# Altium project Center Console.PrjPcb (part 1 of 2)
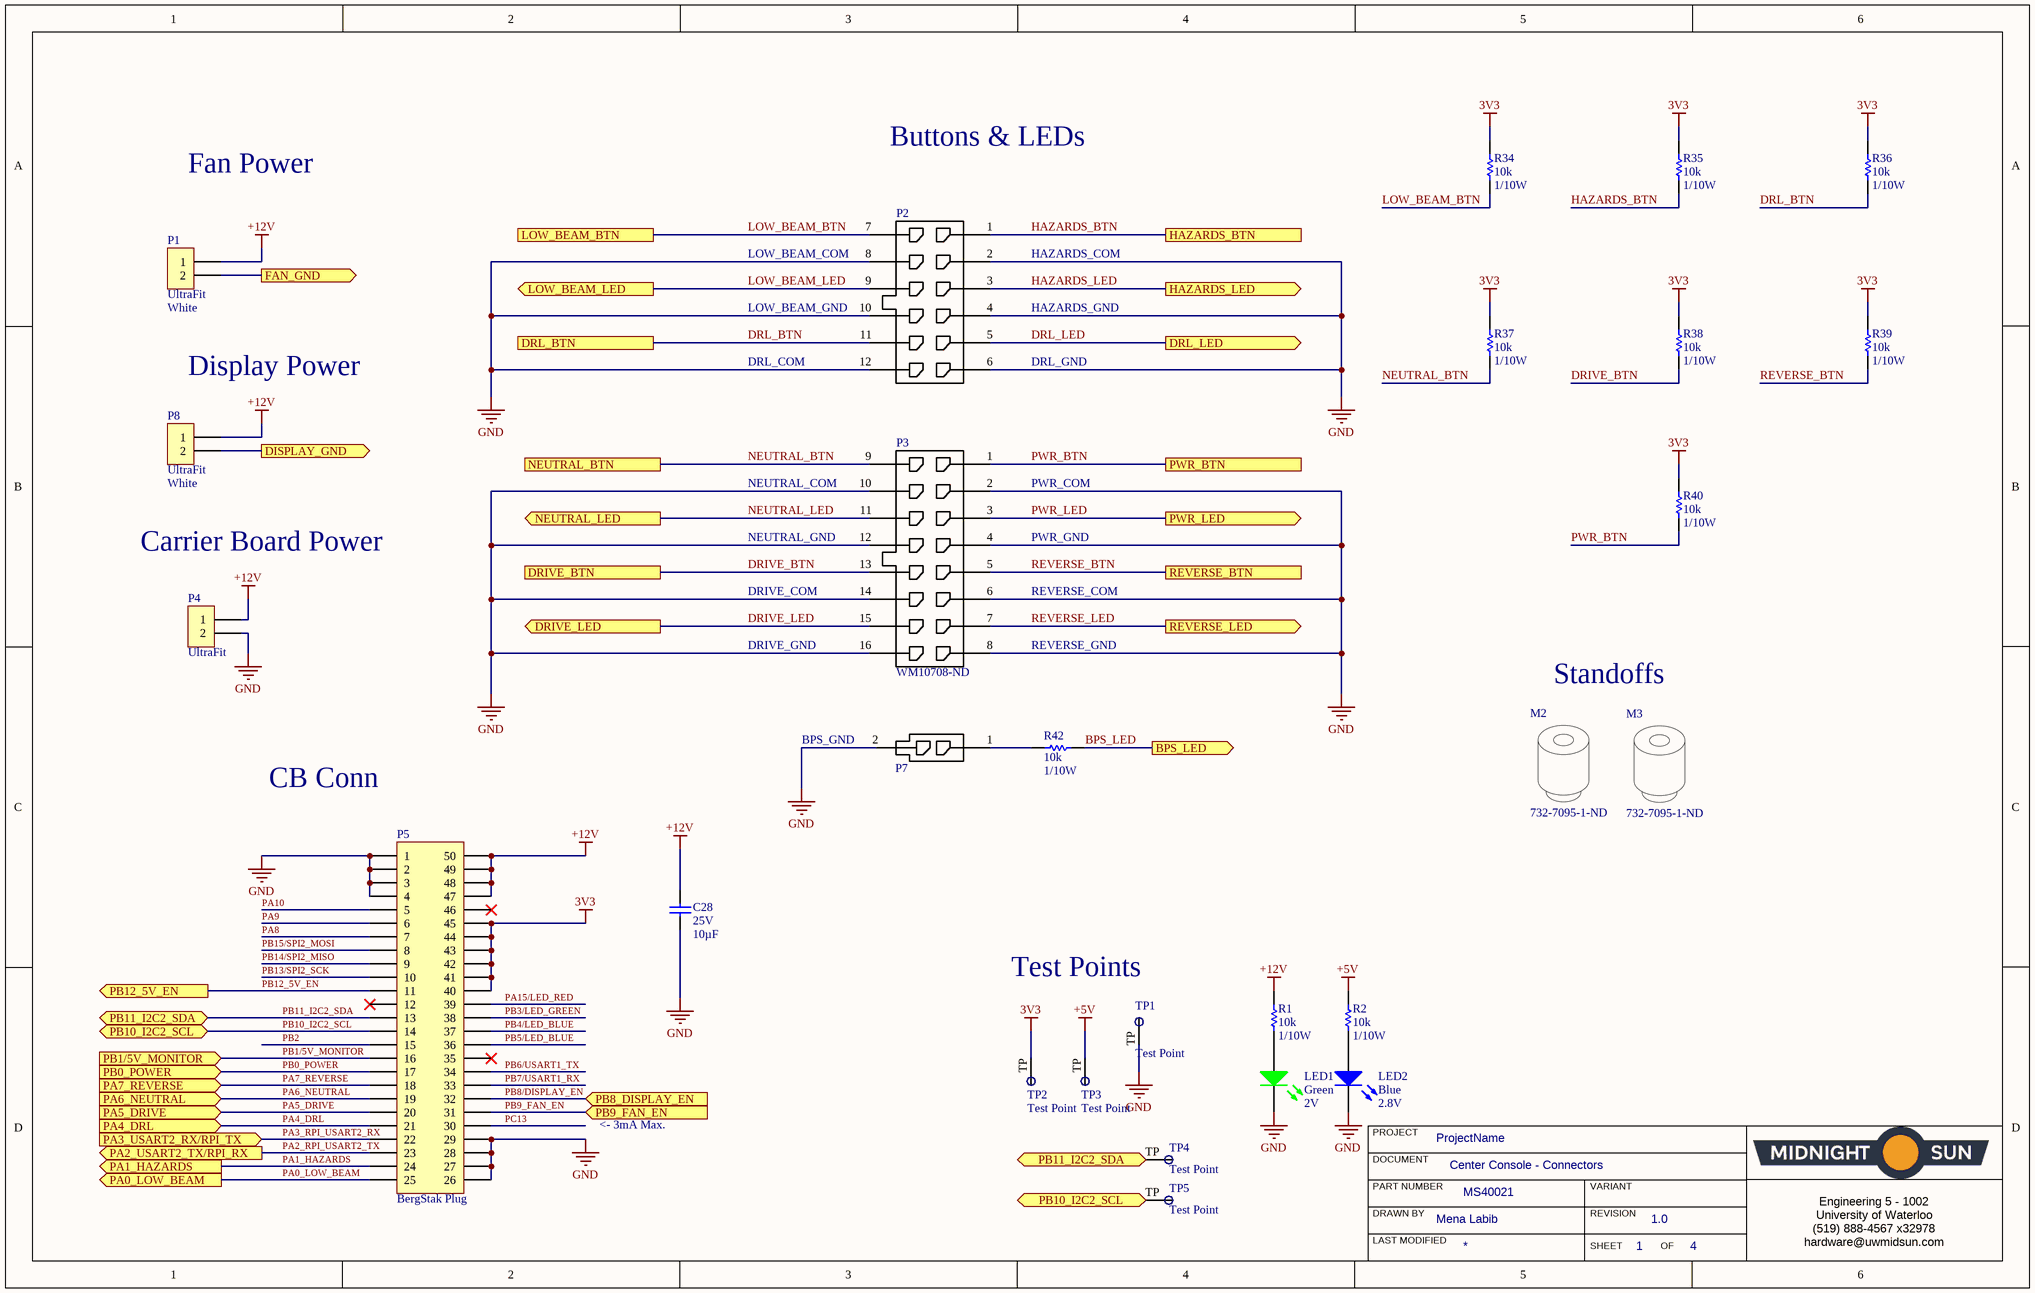
[diagram p0: Center Console - Connectors.SchDoc]
MSPartNumber: MS40021; ProjectAuthor: Mena Labib; ProjectRevision: 1.0
4 sheets, 110 parts. Net scope: flat (ports and power ports of the same name join across sheets).
Board file: Center Console.PcbDoc
Sheets:
  Center Console - Connectors.SchDoc
  Center Console - Buttons Interface.SchDoc
  Center Console - LED Interface.SchDoc
  Center Console - Raspberry Pi Interface.SchDoc

## Sheet Center Console - Connectors.SchDoc: Center Console - Connectors
size B; Organization: Midnight Sun Solar Rayce Car Team; Address1: University of Waterloo; Address2: 200 University Ave W; Address3: Waterloo, ON, Canada; Address4: N2L 3E9; DocumentNumber: 1; SheetNumber: 1; SheetTotal: 4; Website: www.uwmidsun.com; ProjectName: ProjectName

### Parts
C28  Voltage - Rated: 25V  Capacitance: 10µF  [CAP, 0805]  (hidden comment: CAP CER 10uF 25V 10% X5R 0805)
LED1  Color: Green  Voltage - Forward (Vf) (Typ): 2V  [LED_0603]  (hidden comment: LED GREEN CLEAR 2V 0603)
LED2  Color: Blue  Voltage - Forward (Vf) (Typ): 2.8V  [LED_0603]  (hidden comment: LED BLUE CLEAR 2.8V 0603)
M2  Supplier Part Number 1: 732-7095-1-ND  [STANDOFF RND M2.5X0.45 STEEL 5MM]  (hidden comment: STANDOFF RND M2.5X0.45 STEEL 5MM)
M3  Supplier Part Number 1: 732-7095-1-ND  [STANDOFF RND M2.5X0.45 STEEL 5MM]  (hidden comment: STANDOFF RND M2.5X0.45 STEEL 5MM)
P1  Series: UltraFit  Color: White  [CONN, 2POS ULTRA-FIT - NATURAL COLOR]  (hidden comment: CONN 2POS ULTRA-FIT NATURAL COLOR 0.138")
P2  CONN 12POS MICRO-FIT 3mm  [CONN, 12POS MICRO-FIT 3mm]  (value not drawn)
P3  Supplier Part Number 1: WM10708-ND  [CONN, 16POS MICRO-FIT 3MM]  (hidden comment: CONN 16POS MICRO-FIT 3mm)
P4  Series: UltraFit  [CONN, 2POS ULTRA-FIT]  (hidden comment: CONN 2POS ULTRA-FIT 0.138")
P5  Series: BergStak Plug  [CONN, Bergstak 50 Pos Plug]  (hidden comment: CONN 50POS Bergstak Plug 0.02")
P7  CONN 2POS MICRO-FIT 3mm  [CONN, 2POS MICRO-FIT]  (value not drawn)
P8  Series: UltraFit  Color: White  [CONN, 2POS ULTRA-FIT - NATURAL COLOR]  (hidden comment: CONN 2POS ULTRA-FIT NATURAL COLOR 0.138")
R1  Resistance: 10k  Power: 1/10W  [RES, 0603]  (hidden comment: RES 10K OHM 1% 1/10W 0603)
R2  Resistance: 10k  Power: 1/10W  [RES, 0603]  (hidden comment: RES 10K OHM 1% 1/10W 0603)
R34  Resistance: 10k  Power: 1/10W  [RES, 0603]  (hidden comment: RES 10K OHM 1% 1/10W 0603)
R35  Resistance: 10k  Power: 1/10W  [RES, 0603]  (hidden comment: RES 10K OHM 1% 1/10W 0603)
R36  Resistance: 10k  Power: 1/10W  [RES, 0603]  (hidden comment: RES 10K OHM 1% 1/10W 0603)
R37  Resistance: 10k  Power: 1/10W  [RES, 0603]  (hidden comment: RES 10K OHM 1% 1/10W 0603)
R38  Resistance: 10k  Power: 1/10W  [RES, 0603]  (hidden comment: RES 10K OHM 1% 1/10W 0603)
R39  Resistance: 10k  Power: 1/10W  [RES, 0603]  (hidden comment: RES 10K OHM 1% 1/10W 0603)
R40  Resistance: 10k  Power: 1/10W  [RES, 0603]  (hidden comment: RES 10K OHM 1% 1/10W 0603)
R42  Resistance: 10k  Power: 1/10W  [RES, 0603]  (hidden comment: RES 10K OHM 1% 1/10W 0603)
TP1  Test Point  [Test Point]  (no BOM)
TP2  Test Point  [Test Point]  (no BOM)
TP3  Test Point  [Test Point]  (no BOM)
TP4  Test Point  [Test Point]  (no BOM)
TP5  Test Point  [Test Point]  (no BOM)

### Ports
BPS_LED (out), DISPLAY_GND (out), DRIVE_BTN, DRIVE_LED (out), DRL_BTN, DRL_LED (out), FAN_GND (out), HAZARDS_BTN, HAZARDS_LED (out), LOW_BEAM_BTN, LOW_BEAM_LED (out), NEUTRAL_BTN, NEUTRAL_LED (out), PA0_LOW_BEAM (out), PA1_HAZARDS (out), PA2_USART2_TX/RPI_RX (out), PA3_USART2_RX/RPI_TX (in), PA4_DRL (in), PA5_DRIVE (in), PA6_NEUTRAL (in), PA7_REVERSE (in), PB0_POWER (in), PB1/5V_MONITOR (in), PB8_DISPLAY_EN (in), PB9_FAN_EN (in), PB10_I2C2_SCL (bidir), PB11_I2C2_SDA (bidir), PB12_5V_EN (out), PWR_BTN, PWR_LED (out), REVERSE_BTN, REVERSE_LED (out)

### Nets
3V3: P5.40 P5.41 P5.42 P5.43 P5.44 P5.45 R34.1 R35.1 R36.1 R37.1 R38.1 R39.1 R40.1 TP2.TP
+5V: R2.1 TP3.TP
+12V: C28.1 P1.1 P4.1 P5.47 P5.48 P5.49 P5.50 P8.1 R1.1
GND: C28.2 LED1.2(K) LED2.2(K) P2.2 P2.4 P2.6 P2.8 P2.10 P2.12 P3.2 P3.4 P3.6 P3.8 P3.10 P3.12 P3.14 P3.16 P4.2 P5.1 P5.2 P5.3 P5.4 P5.26 P5.27 P5.28 P5.29 P7.2 TP1.TP
BPS_LED: R42.2 ; port BPS_LED
DISPLAY_GND: P8.2 ; port DISPLAY_GND
DRIVE_BTN: P3.13 R38.2 ; port DRIVE_BTN
DRIVE_LED: P3.15 ; port DRIVE_LED
DRL_BTN: P2.11 R36.2 ; port DRL_BTN
DRL_LED: P2.5 ; port DRL_LED
FAN_GND: P1.2 ; port FAN_GND
HAZARDS_BTN: P2.1 R35.2 ; port HAZARDS_BTN
HAZARDS_LED: P2.3 ; port HAZARDS_LED
LOW_BEAM_BTN: P2.7 R34.2 ; port LOW_BEAM_BTN
LOW_BEAM_LED: P2.9 ; port LOW_BEAM_LED
NEUTRAL_BTN: P3.9 R37.2 ; port NEUTRAL_BTN
NEUTRAL_LED: P3.11 ; port NEUTRAL_LED
PA0_LOW_BEAM: P5.25 ; port PA0_LOW_BEAM
PA1_HAZARDS: P5.24 ; port PA1_HAZARDS
PA2_RPI_USART2_TX: P5.23 ; port PA2_USART2_TX/RPI_RX
PA3_RPI_USART2_RX: P5.22 ; port PA3_USART2_RX/RPI_TX
PA4_DRL: P5.21 ; port PA4_DRL
PA5_DRIVE: P5.20 ; port PA5_DRIVE
PA6_NEUTRAL: P5.19 ; port PA6_NEUTRAL
PA7_REVERSE: P5.18 ; port PA7_REVERSE
PA8: P5.7  [project net PA8_1]
PA9: P5.6  [project net PA9_1]
PA10: P5.5  [project net PA10_1]
PA15/LED_RED: P5.39  [project net PA15/LED_RED_1]
PB0_POWER: P5.17 ; port PB0_POWER
PB1/5V_MONITOR: P5.16 ; port PB1/5V_MONITOR
PB2: P5.15  [project net PB2_1]
PB3/LED_GREEN: P5.38  [project net PB3/LED_GREEN_1]
PB4/LED_BLUE: P5.37  [project net PB4/LED_BLUE_1]
PB5/LED_BLUE: P5.36  [project net PB5/LED_BLUE_1]
PB6/USART1_TX: P5.34  [project net PB6/USART1_TX_1]
PB7/USART1_RX: P5.33  [project net PB7/USART1_RX_1]
PB8/DISPLAY_EN: P5.32 ; port PB8_DISPLAY_EN
PB9_FAN_EN: P5.31 ; port PB9_FAN_EN
PB10_I2C2_SCL: P5.14 TP5.TP ; port PB10_I2C2_SCL
PB11_I2C2_SDA: P5.13 TP4.TP ; port PB11_I2C2_SDA
PB12_5V_EN: P5.11 ; port PB12_5V_EN
PB13/SPI2_SCK: P5.10  [project net PB13/SPI2_SCK_1]
PB14/SPI2_MISO: P5.9  [project net PB14/SPI2_MISO_1]
PB15/SPI2_MOSI: P5.8  [project net PB15/SPI2_MOSI_1]
PC13: P5.30  [project net PC13_1]
PWR_BTN: P3.1 R40.2 ; port PWR_BTN
PWR_LED: P3.3 ; port PWR_LED
REVERSE_BTN: P3.5 R39.2 ; port REVERSE_BTN
REVERSE_LED: P3.7 ; port REVERSE_LED
NetLED1_1: LED1.1(A) R1.2
NetLED2_1: LED2.1(A) R2.2
NetP7_1: P7.1 R42.1

Not connected (* = marked no-connect by the designer): P5 12* 35* 46*

### Notes on the sheet
- Buttons & LEDs
- Fan Power
- LOW_BEAM_COM
- HAZARDS_COM
- LOW_BEAM_GND
- DRL_COM
- HAZARDS_GND
- DRL_GND
- Display Power
- NEUTRAL_COM
- PWR_COM
- Carrier Board Power
- NEUTRAL_GND
- PWR_GND
- DRIVE_COM
- REVERSE_COM
- DRIVE_GND
- REVERSE_GND
- Standoffs
- BPS_GND
- CB Conn
- (near TP1) Test Points
- <- 3mA Max.
- PROJECT
- DOCUMENT
- DRAWN BY
- LAST MODIFIED
- PART NUMBER
- REVISION
- SHEET
- VARIANT
- OF
- Engineering 5 - 1002
  University of Waterloo
  (519) 888-4567 x32978
  hardware@uwmidsun.com

### Library data of the parts
C28 = CAP CER 10uF 25V 10% X5R 0805: 10µF ±10% 25V Ceramic Capacitor X5R 0805 (2012 Metric); Manufacturer: Murata Electronics North America; Manufacturer Part Number: GRM21BR61E106KA73L; Supplier 1: Digi-Key; RoHS: RoHS Compliant; Category: Capacitors; Stock 1: 1695157; Packaging: Cut Tape (CT); Part Status: Active; Tolerance: ±10%; Temperature Coefficient: X5R; Operating Temperature: -55°C ~ 85°C; Features: -; Ratings: -; Applications: General Purpose; Mounting Type: Surface Mount, MLCC; Package / Case: 0805 (2012 Metric); Size / Dimension: 0.079" L x 0.049" W (2.00mm x 1.25mm); Height - Seated (Max): -; Thickness (Max): 0.053" (1.35mm); Lead Spacing: -; Lead Style: -; ComponentLink1URL: http://search.murata.co.jp/Ceramy/image/img/A01X/G101/ENG/GRM21BR61E106KA73-01.pdf; ComponentLink1Description: http://search.murata.co.jp/Ceramy/image/img/A01X/G101/ENG/GRM21BR61E106KA73-01.pdf; Supplier Part Number 1: 490-5523-1-ND; Pricing 1: 1=0.3, 10=0.214, 100=0.1008, 500=0.07068, 1000=0.05851 (CAD)
LED1 = LED GREEN CLEAR 2V 0603: Green 572nm LED Indication - Discrete 2V 0603 (1608 Metric); Manufacturer: Wurth Electronics Inc.; Manufacturer Part Number: 150060VS75000; Lens Color: Colorless; Millicandela Rating: 40mcd; Lens Style/Size: Rectangle with Flat Top, 1.10mm x 0.70mm; Current - Test: 20mA; Viewing Angle: 140°; Wavelength - Dominant: 570nm; Supplier 1: Digi-Key; RoHS: RoHS Compliant; Category: Optoelectronics; Stock 1: 9408; Pricing 1: 1=0.21, 100=0.1617, 500=0.13964 (CAD); Packaging: Cut Tape (CT); Part Status: Active; Lens Transparency: Clear; Mounting Type: Surface Mount; Wavelength - Peak: 572nm; Features: -; Package / Case: 0603 (1608 Metric); Supplier Device Package: 0603; Size / Dimension: 1.60mm L x 0.80mm W; Height (Max): 0.80mm; ComponentLink1URL: http://katalog.we-online.de/led/datasheet/150060VS75000.pdf; ComponentLink1Description: http://katalog.we-online.de/led/datasheet/150060VS75000.pdf; Supplier Part Number 1: 732-4980-1-ND
LED2 = LED BLUE CLEAR 2.8V 0603: Blue 470nm LED Indication - Discrete 2.8V 0603 (1608 Metric); Manufacturer 1: Lite-On Inc.; Manufacturer Part Number 1: LTST-C193TBKT-5A; Lens Color: Colorless; Millicandela Rating: 15mcd; Lens Style/Size: Rectangle with Flat Top, 1.15mm x 0.80mm; Current - Test: 5mA; Viewing Angle: 130°; Wavelength - Peak: 468nm; Supplier 1: Digi-Key; Supplier Part Number 1: 160-1827-1-ND; Packaging: Cut Tape (CT); Part Status: Active; Lens Transparency: Clear; Mounting Type: Surface Mount; Wavelength - Dominant: 470nm; Package / Case: 0603 (1608 Metric); Supplier Device Package: Chip LED; Size / Dimension: 1.60mm L x 0.80mm W; Height (Max): 0.45mm; ComponentLink1URL: http://optoelectronics.liteon.com/upload/download/DS22-2004-060/P_100_LTST-C193TBKT-5A.pdf; ComponentLink1Description: http://optoelectronics.liteon.com/upload/download/DS22-2004-060/P_100_LTST-C193TBKT-5A.pdf
M2 M3 = STANDOFF RND M2.5X0.45 STEEL 5MM: Manufacturer: Wurth Electronics; Manufacturer Part Number: 9774050151R; Plating: Tin; Threaded/Unthreaded: Threaded; Outside Diameter: 0.201inch; Supplier 1: Digi-Key; RoHS: Yes; Stock 1: 24846; Pricing 1: 1 = 1.09000, 10 = 1.03000, 50 = 0.91800, 100 = 0.84000 (USD); Material: Steel; Length: 0.252inch; REACH SVHC: Unknown
P1 P8 = CONN 2POS ULTRA-FIT NATURAL COLOR 0.138": 2 Positions Header, Shrouded Connector 0.138" (3.50mm) Through Hole; Manufacturer 1: Molex, LLC; Manufacturer Part Number 1: 1722872102; Style: Board to Cable/Wire; Shrouding: Shrouded - 4 Wall; Number of Positions: 2; Number of Positions Loaded: All; Contact Length - Post: 0.126" (3.20mm); Material Flammability Rating: UL94 V-0; Mated Stacking Heights: 26.99mm; Voltage: 400V; Supplier 1: Digi-Key; Supplier Part Number 1: WM11722-ND; Packaging: Tray; Part Status: Active; Connector Type: Header; Contact Type: Male Pin; Pitch - Mating: 0.138" (3.50mm); Number of Rows: 1; Row Spacing - Mating: -; Mounting Type: Through Hole; Termination: Solder; Fastening Type: Latch Holder; Contact Length - Mating: -; Overall Contact Length: -; Insulation Height: 0.465" (11.80mm); Contact Shape: Square; Contact Finish - Mating: Tin; Contact Finish Thickness - Mating: 60µin (1.52µm); Contact Finish - Post: Tin; Contact Material: Copper Alloy; Insulation Material: Liquid Crystal Polymer (LCP); Operating Temperature: -40°C ~ 105°C; Ingress Protection: -; Insulation Color: Natural; Current Rating: -; Contact Finish Thickness - Post: 60µin (1.52µm); ComponentLink1URL: http://www.molex.com/pdm_docs/sd/1722872102_sd.pdf; ComponentLink1Description: http://www.molex.com/pdm_docs/sd/1722872102_sd.pdf
P2 = CONN 12POS MICRO-FIT 3mm: Connector Header Through Hole 12 position 0.118" (3.00mm); Manufacturer: Molex, LLC; Manufacturer Part Number: 0430451227; Number of Positions: 12; Number of Positions Loaded: All; Style: Board to Cable/Wire; Shrouding: Shrouded - 4 Wall; Contact Length - Post: 0.125" (3.18mm); Material Flammability Rating: UL94 V-0; Supplier 1: Digi-Key; RoHS: RoHS Compliant; Category: Connectors, Interconnects; Stock 1: 1709; Pricing 1: 1=3.61, 10=3.283, 25=3.0816, 50=2.9478, 100=2.8138, 250=2.5458, 500=2.34482, 1008=2.00985, 3024=1.87586 (CAD); Packaging: Tray; Part Status: Active; Connector Type: Header; Contact Type: Male Pin; Pitch - Mating: 0.118" (3.00mm); Number of Rows: 2; Row Spacing - Mating: 0.118" (3.00mm); Mounting Type: Through Hole; Termination: Solder; Fastening Type: Locking Ramp; Contact Length - Mating: -; Overall Contact Length: -; Insulation Height: 0.390" (9.91mm); Contact Shape: Square; Contact Finish - Mating: Tin; Contact Finish Thickness - Mating: 60.0µin (1.52µm); Contact Finish - Post: Tin; Contact Material: Brass; Insulation Material: Liquid Crystal Polymer (LCP), Glass Filled; Features: Board Guide; Operating Temperature: -; Ingress Protection: -; Insulation Color: Black; Current Rating: -; Voltage Rating: -; Mated Stacking Heights: -; Contact Finish Thickness - Post: -; Applications: General Purpose, Medical, Military, Telecommunications; ComponentLink1URL: https://www.molex.com/pdm_docs/sd/430451227_sd.pdf; ComponentLink1Description: https://www.molex.com/pdm_docs/sd/430451227_sd.pdf; Supplier Part Number 1: WM10697-ND
P3 = CONN 16POS MICRO-FIT 3mm: Connector Header Through Hole 16 position 0.118"(3.00mm); Manufacturer: Molex; Manufacturer Part Number: 0430451627; Contact Resistance: 10mR; Number of Positions: 16; Number of Ports: 1; Connector Type: Male Pin; Row Spacing: 0.118inch; Supplier 1: Digi-Key; RoHS: Yes; Stock 1: 4654; Pricing 1: 1 = 3.26000, 10 = 3.12900, 25 = 2.86800, 50 = 2.73780, 100 = 2.60740, 250 = 2.28148, 792 = 2.02073, 1584 = 1.82518, 3168 = 1.75999 (USD); Mount: Through Hole; Color: Black; Contact Material: Brass; Contact Plating: Tin; Number of Terminals: 16; Housing Color: Black; Housing Material: Polymer; Min Operating Temperature: -40°C; Max Operating Temperature: 105°C; Package Quantity: 792; Number of Rows: 2; Fastening Type: Ramp; Packaging: Tray; Termination: Solder; Number of Contacts: 16; Orientation: Straight; Length: 28.15mm; Pitch: 3mm; Depth: 8.77mm; ComponentLink1URL: http://www.molex.com/pdm_docs/sd/430451627_sd.pdf; ComponentLink1Description: http://www.molex.com/pdm_docs/sd/430451627_sd.pdf; ComponentLink2URL: http://www.molex.com/webdocs/datasheets/pdf/en-us/0430451627_PCB_HEADERS.pdf; ComponentLink2Description: http://www.molex.com/webdocs/datasheets/pdf/en-us/0430451627_PCB_HEADERS.pdf
P4 = CONN 2POS ULTRA-FIT 0.138": 2 Positions Header, Shrouded Connector 0.138" (3.50mm) Through Hole Gold; Manufacturer 1: Molex, LLC; Manufacturer Part Number 1: 1722861302; Style: Board to Board or Cable; Shrouding: Shrouded - 4 Wall; Number of Positions: 2; Number of Positions Loaded: All; Contact Length - Post: 0.126" (3.20mm); Material Flammability Rating: UL94 V-0; Mated Stacking Heights: 26.99mm; Voltage: 400V; Supplier 1: Digi-Key; Supplier Part Number 1: WM11673-ND; Packaging: Tray; Part Status: Active; Connector Type: Header; Contact Type: Male Pin; Pitch - Mating: 0.138" (3.50mm); Number of Rows: 1; Row Spacing - Mating: -; Mounting Type: Through Hole; Termination: Kinked Pin, Solder; Fastening Type: Latch Holder; Contact Length - Mating: -; Overall Contact Length: -; Insulation Height: 0.465" (11.80mm); Contact Shape: Square; Contact Finish - Mating: Gold; Contact Finish Thickness - Mating: 30µin (0.76µm); Contact Finish - Post: Tin; Contact Material: Copper Alloy; Insulation Material: Liquid Crystal Polymer (LCP); Operating Temperature: -40°C ~ 120°C; Ingress Protection: -; Insulation Color: Black; Current Rating: -; Contact Finish Thickness - Post: 60µin (1.52µm); ComponentLink1URL: http://www.molex.com/pdm_docs/sd/1722861302_sd.pdf; ComponentLink1Description: http://www.molex.com/pdm_docs/sd/1722861302_sd.pdf
P5 = CONN 50POS Bergstak Plug 0.02": 50 Position Connector Plug, Outer Shroud Contacts Surface Mount Gold; Manufacturer 1: Amphenol FCI; Manufacturer Part Number 1: 10132797-055100LF; Number of Positions: 50; Mated Stacking Heights: 5mm; Pitch: 0.020" (0.50mm); Supplier 1: Digi-Key; Supplier Part Number 1: 609-5226-1-ND; Packaging: Cut Tape (CT); Part Status: Active; Connector Type: Plug, Outer Shroud Contacts; Number of Rows: 2; Mounting Type: Surface Mount; Contact Finish: Gold; Contact Finish Thickness: 1µin (0.025µm); Height Above Board: 0.169" (4.30mm); ComponentLink1URL: http://portal.fciconnect.com/Comergent//fci/drawing/10132797.pdf; ComponentLink1Description: http://portal.fciconnect.com/Comergent//fci/drawing/10132797.pdf
P7 = CONN 2POS MICRO-FIT 3mm: Connector Header Through Hole 2 position; Manufacturer: Molex; Manufacturer Part Number: 43045-0227; Number of Positions: 2; Gender: Male; Contact Resistance: 10mR; Number of Ports: 1; Max Voltage Rating (DC): 250.25kV; Current Rating: 5A; Voltage Rating: 600V; Glow Wire Compliant: Compliant; Supplier 1: Digi-Key; Stock 1: 3657; Pricing 1: 1=0.84, 10=0.74, 25=0.6968, 50=0.6676, 100=0.6387, 250=0.5806, 500=0.52254, 1000=0.46448, 2500=0.42094 (USD); Mount: Through Hole; Contact Plating: Tin; Contact Material: Brass; Housing Colour: Black; Housing Material: Thermoplastic; Number of Terminals: 2; Min Operating Temperature: -40°C; Max Operating Temperature: 105°C; Number of Rows: 2; Packaging: Tray; Termination: Solder; Number of Contacts: 2; Orientation: Vertical; Package Quantity: 3168; Number of Circuits: 2; Length: 7.15mm; Pitch: 3mm; Depth: 8.77mm; Row Spacing: 3mm; Radiation Hardening: No; Halogen Free: Low Halogen; ComponentLink1URL: http://www.onlinecomponents.com/productFiles/mf-MOL/307170430450227_pcb_headers.pdf; ComponentLink1Description: http://www.onlinecomponents.com/productFiles/mf-MOL/307170430450227_pcb_headers.pdf; ComponentLink2URL: http://www.mouser.com/ds/2/276/0430450227_PCB_HEADERS-142611.pdf; ComponentLink2Description: http://www.mouser.com/ds/2/276/0430450227_PCB_HEADERS-142611.pdf; ComponentLink3URL: http://uk.rs-online.com/webdocs/13c3/0900766b813c3a46.pdf; ComponentLink3Description: http://uk.rs-online.com/webdocs/13c3/0900766b813c3a46.pdf; ComponentLink4URL: http://www.molex.com/webdocs/datasheets/pdf/en-us/0430450227_PCB_HEADERS.pdf; ComponentLink4Description: http://www.molex.com/webdocs/datasheets/pdf/en-us/0430450227_PCB_HEADERS.pdf; Supplier Part Number 1: WM10657-ND
R1 R2 R34-R40 R42 = RES 10K OHM 1% 1/10W 0603: RES SMD 10K OHM 1% 1/10W 0603; Manufacturer 1: Yageo; Manufacturer Part Number 1: RC0603FR-0710KL; Temperature Coefficient: ±100ppm/°C; Supplier 1: Digi-Key; Supplier Part Number 1: 311-10.0KHRCT-ND; Packaging: Cut Tape (CT); Part Status: Active; Composition: Thick Film; Operating Temperature: -55°C ~ 155°C; Package / Case: 0603 (1608 Metric); Supplier Device Package: 0603; Size / Dimension: 0.063" L x 0.031" W (1.60mm x 0.80mm); Height - Seated (Max): 0.022" (0.55mm); Failure Rate: -; ComponentLink1URL: http://www.yageo.com/documents/recent/PYu-RC_Group_51_RoHS_L_7.pdf; ComponentLink1Description: http://www.yageo.com/documents/recent/PYu-RC_Group_51_RoHS_L_7.pdf; Tolerance: ±1%

## Sheet Center Console - Buttons Interface.SchDoc: Center Console - Buttons Interface
size B; Organization: Midnight Sun Solar Rayce Car Team; Address1: University of Waterloo; Address2: 200 University Ave W; Address3: Waterloo, ON, Canada; Address4: N2L 3E9; DocumentNumber: 2; SheetNumber: 2; SheetTotal: 4; Website: www.uwmidsun.com; ProjectName: ProjectName
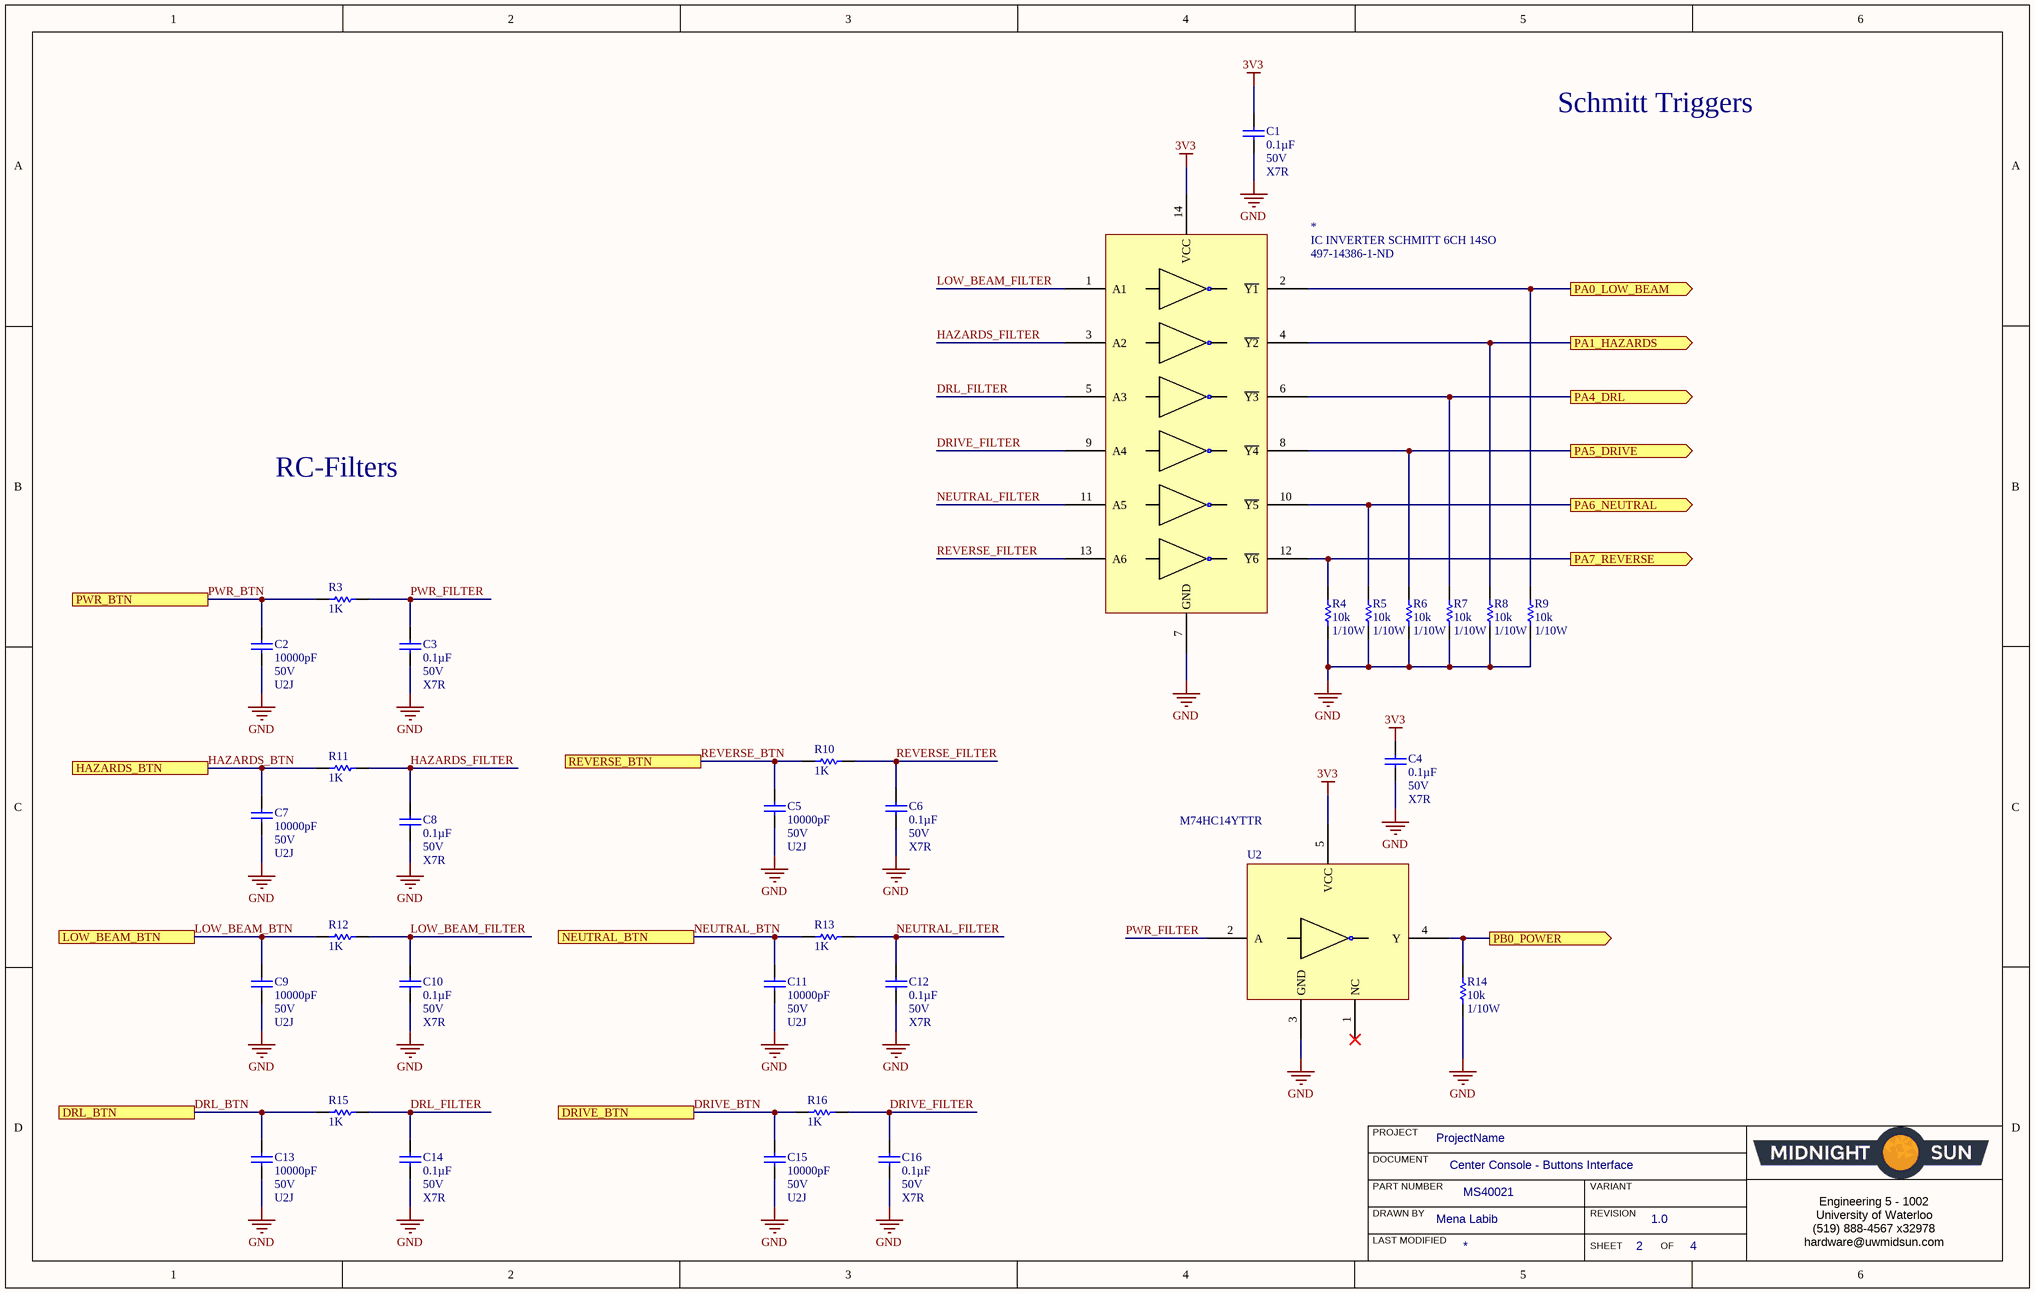
[diagram p1: Center Console - Buttons Interface.SchDoc]

### Parts
*  IC INVERTER SCHMITT 6CH 14SO  Supplier Part Number 1: 497-14386-1-ND  [IC INVERTER SCHMITT 6CH 14TSO]
C1  Capacitance: 0.1µF  Voltage: 50V  Temperature Coefficient: X7R  [CAP, 0603]  (hidden comment: CAP CER 0.1UF 50V 10% X7R 0603)
C2  Capacitance: 10000pF  Voltage: 50V  Temperature Coefficient: U2J  [CAP, 0603]  (hidden comment: CAP CER 10nF 50V 5% X7R 0603)
C3  Capacitance: 0.1µF  Voltage: 50V  Temperature Coefficient: X7R  [CAP, 0603]  (hidden comment: CAP CER 0.1UF 50V 10% X7R 0603)
C4  Capacitance: 0.1µF  Voltage: 50V  Temperature Coefficient: X7R  [CAP, 0603]  (hidden comment: CAP CER 0.1UF 50V 10% X7R 0603)
C5  Capacitance: 10000pF  Voltage: 50V  Temperature Coefficient: U2J  [CAP, 0603]  (hidden comment: CAP CER 10nF 50V 5% X7R 0603)
C6  Capacitance: 0.1µF  Voltage: 50V  Temperature Coefficient: X7R  [CAP, 0603]  (hidden comment: CAP CER 0.1UF 50V 10% X7R 0603)
C7  Capacitance: 10000pF  Voltage: 50V  Temperature Coefficient: U2J  [CAP, 0603]  (hidden comment: CAP CER 10nF 50V 5% X7R 0603)
C8  Capacitance: 0.1µF  Voltage: 50V  Temperature Coefficient: X7R  [CAP, 0603]  (hidden comment: CAP CER 0.1UF 50V 10% X7R 0603)
C9  Capacitance: 10000pF  Voltage: 50V  Temperature Coefficient: U2J  [CAP, 0603]  (hidden comment: CAP CER 10nF 50V 5% X7R 0603)
C10  Capacitance: 0.1µF  Voltage: 50V  Temperature Coefficient: X7R  [CAP, 0603]  (hidden comment: CAP CER 0.1UF 50V 10% X7R 0603)
C11  Capacitance: 10000pF  Voltage: 50V  Temperature Coefficient: U2J  [CAP, 0603]  (hidden comment: CAP CER 10nF 50V 5% X7R 0603)
C12  Capacitance: 0.1µF  Voltage: 50V  Temperature Coefficient: X7R  [CAP, 0603]  (hidden comment: CAP CER 0.1UF 50V 10% X7R 0603)
C13  Capacitance: 10000pF  Voltage: 50V  Temperature Coefficient: U2J  [CAP, 0603]  (hidden comment: CAP CER 10nF 50V 5% X7R 0603)
C14  Capacitance: 0.1µF  Voltage: 50V  Temperature Coefficient: X7R  [CAP, 0603]  (hidden comment: CAP CER 0.1UF 50V 10% X7R 0603)
C15  Capacitance: 10000pF  Voltage: 50V  Temperature Coefficient: U2J  [CAP, 0603]  (hidden comment: CAP CER 10nF 50V 5% X7R 0603)
C16  Capacitance: 0.1µF  Voltage: 50V  Temperature Coefficient: X7R  [CAP, 0603]  (hidden comment: CAP CER 0.1UF 50V 10% X7R 0603)
R3  1K  [RES, 0603]
R4  Resistance: 10k  Power: 1/10W  [RES, 0603]  (hidden comment: RES 10K OHM 1% 1/10W 0603)
R5  Resistance: 10k  Power: 1/10W  [RES, 0603]  (hidden comment: RES 10K OHM 1% 1/10W 0603)
R6  Resistance: 10k  Power: 1/10W  [RES, 0603]  (hidden comment: RES 10K OHM 1% 1/10W 0603)
R7  Resistance: 10k  Power: 1/10W  [RES, 0603]  (hidden comment: RES 10K OHM 1% 1/10W 0603)
R8  Resistance: 10k  Power: 1/10W  [RES, 0603]  (hidden comment: RES 10K OHM 1% 1/10W 0603)
R9  Resistance: 10k  Power: 1/10W  [RES, 0603]  (hidden comment: RES 10K OHM 1% 1/10W 0603)
R10  1K  [RES, 0603]
R11  1K  [RES, 0603]
R12  1K  [RES, 0603]
R13  1K  [RES, 0603]
R14  Resistance: 10k  Power: 1/10W  [RES, 0603]  (hidden comment: RES 10K OHM 1% 1/10W 0603)
R15  1K  [RES, 0603]
R16  1K  [RES, 0603]
U2  Manufacturer Part Number: M74HC14YTTR  [IC INVERTER SCHMITT 1CH SC70-5]  (hidden comment: IC INVERTER SCHMITT 1CH SC70-5)

### Ports
DRIVE_BTN, DRL_BTN, HAZARDS_BTN, LOW_BEAM_BTN, NEUTRAL_BTN, PA0_LOW_BEAM (out), PA1_HAZARDS (out), PA4_DRL (out), PA5_DRIVE (out), PA6_NEUTRAL (out), PA7_REVERSE (out), PB0_POWER (out), PWR_BTN, REVERSE_BTN

### Nets
3V3: *.14(VCC) C1.1 C4.1 U2.5(VCC)
GND: *.7(GND) C1.2 C2.2 C3.2 C4.2 C5.2 C6.2 C7.2 C8.2 C9.2 C10.2 C11.2 C12.2 C13.2 C14.2 C15.2 C16.2 R4.2 R5.2 R6.2 R7.2 R8.2 R9.2 R14.2 U2.3(GND)
DRIVE_BTN: C15.1 R16.1 ; port DRIVE_BTN
DRIVE_FILTER: *.9(A4) C16.1 R16.2  [project net DRIVE_FILTER_2]
DRL_BTN: C13.1 R15.1 ; port DRL_BTN
DRL_FILTER: *.5(A3) C14.1 R15.2  [project net DRL_FILTER_2]
HAZARDS_BTN: C7.1 R11.1 ; port HAZARDS_BTN
HAZARDS_FILTER: *.3(A2) C8.1 R11.2  [project net HAZARDS_FILTER_2]
LOW_BEAM_BTN: C9.1 R12.1 ; port LOW_BEAM_BTN
LOW_BEAM_FILTER: *.1(A1) C10.1 R12.2  [project net LOW_BEAM_FILTER_2]
NEUTRAL_BTN: C11.1 R13.1 ; port NEUTRAL_BTN
NEUTRAL_FILTER: *.11(A5) C12.1 R13.2  [project net NEUTRAL_FILTER_2]
PA0_LOW_BEAM: *.2(~{Y1}) R9.1 ; port PA0_LOW_BEAM
PA1_HAZARDS: *.4(~{Y2}) R8.1 ; port PA1_HAZARDS
PA4_DRL: *.6(~{Y3}) R7.1 ; port PA4_DRL
PA5_DRIVE: *.8(~{Y4}) R6.1 ; port PA5_DRIVE
PA6_NEUTRAL: *.10(~{Y5}) R5.1 ; port PA6_NEUTRAL
PA7_REVERSE: *.12(~{Y6}) R4.1 ; port PA7_REVERSE
PB0_POWER: R14.1 U2.4(Y) ; port PB0_POWER
PWR_BTN: C2.1 R3.1 ; port PWR_BTN
PWR_FILTER: C3.1 R3.2 U2.2(A)  [project net PWR_FILTER_2]
REVERSE_BTN: C5.1 R10.1 ; port REVERSE_BTN
REVERSE_FILTER: *.13(A6) C6.1 R10.2  [project net REVERSE_FILTER_2]

Not connected (* = marked no-connect by the designer): U2 1(NC)*

### Notes on the sheet
- Schmitt Triggers
- RC-Filters
- PROJECT
- DOCUMENT
- DRAWN BY
- LAST MODIFIED
- PART NUMBER
- REVISION
- SHEET
- VARIANT
- OF
- Engineering 5 - 1002
  University of Waterloo
  (519) 888-4567 x32978
  hardware@uwmidsun.com

### Library data of the parts
* = IC INVERTER SCHMITT 6CH 14SO: Inverter IC 6 Channel Schmitt Trigger 14-SO; Manufacturer: STMicroelectronics; Manufacturer Part Number: M74HC14YTTR; Number of Inputs: 6; Propagation Delay: 21ns; Max Supply Voltage: 6V; Min Supply Voltage: 2V; Quiescent Current: 1uA; High Level Output Current: 5.2mA; Turn-On Delay Time: 25ns; ComponentLink1Description: Digikey; ComponentLink1URL: https://www.digikey.ca/product-detail/en/stmicroelectronics/M74HC14YTTR/497-14387-1-ND/4725844; RoHS: Yes; Mount: Surface Mount; Case/Package: TSSOP; Number of Pins: 14; Weight: 0.004949oz; Min Operating Temperature: -40°C; Max Operating Temperature: 125°C; Packaging: Tape and Reel; Package Quantity: 2500; Logic Function: Inverter; Number of Circuits: 6; Low Level Output Current: 5.2mA; Lead Free: Lead Free; ComponentLink2URL: http://www.st.com/content/ccc/resource/technical/document/datasheet/19/a3/52/42/dd/ab/4b/46/CD00000263.pdf/files/CD00000263.pdf/jcr:content/translations/en.CD00000263.pdf; ComponentLink2Description: http://www.st.com/content/ccc/resource/technical/document/datasheet/19/a3/52/42/dd/ab/4b/46/CD00000263.pdf/files/CD00000263.pdf/jcr:content/translations/en.CD00000263.pdf; ComponentLink3URL: http://www.st.com/st-web-ui/static/active/en/resource/technical/document/datasheet/CD00000263.pdf; ComponentLink3Description: http://www.st.com/st-web-ui/static/active/en/resource/technical/document/datasheet/CD00000263.pdf; Supplier 1: Digi-Key; Stock 1: 28888; Pricing 1: 1 = 0.48000, 10 = 0.41300, 100 = 0.30860, 500 = 0.24246, 1000 = 0.18736 (USD); Number of Elements: 6; ComponentLink4URL: http://www.st.com/content/ccc/resource/technical/document/datasheet/19/a3/52/42/dd/ab/4b/46/CD00000263.pdf/files/CD00000263.pdf/jcr:content/translations/en.CD00000263.pdf?src-supplier=Digi-Key; ComponentLink4Description: http://www.st.com/content/ccc/resource/technical/document/datasheet/19/a3/52/42/dd/ab/4b/46/CD00000263.pdf/files/CD00000263.pdf/jcr:content/translations/en.CD00000263.pdf?src-supplier=Digi-Key; ComponentLink5URL: http://www.st.com/st-web-ui/static/active/en/resource/technical/document/datasheet/CD00000263.pdf?src-supplier=Avnet; ComponentLink5Description: http://www.st.com/st-web-ui/static/active/en/resource/technical/document/datasheet/CD00000263.pdf?src-supplier=Avnet
C1 C3 C4 C6 C8 C10 C12 C14 C16 = CAP CER 0.1UF 50V 10% X7R 0603: 0.10µF ±10% 50V Ceramic Capacitor X7R 0603 (1608 Metric); Manufacturer 1: AVX Corporation; Manufacturer Part Number 1: 06035C104KAT2A; Supplier 1: Digi-Key; Supplier Part Number 1: 478-5052-1-ND; Packaging: Cut Tape (CT); Part Status: Active; Operating Temperature: -55°C ~ 125°C; Ratings: -; Mounting Type: Surface Mount, MLCC; Package / Case: 0603 (1608 Metric); Size / Dimension: 0.063" L x 0.032" W (1.60mm x 0.81mm); Height - Seated (Max): -; Thickness (Max): 0.035" (0.90mm); Lead Spacing: -; Lead Style: -; ComponentLink1URL: http://datasheets.avx.com/X7RDielectric.pdf; ComponentLink1Description: http://datasheets.avx.com/X7RDielectric.pdf; Tolerance: ±10%
C2 C5 C7 C9 C11 C13 C15 = CAP CER 10nF 50V 5% X7R 0603: 10000pF ±5% 50V Ceramic Capacitor U2J 0603 (1608 Metric); Manufacturer 1: KEMET; Manufacturer Part Number 1: C0603C103J5JAC7867; Supplier 1: Digi-Key; Supplier Part Number 1: 399-13384-1-ND; Packaging: Cut Tape (CT); Part Status: Active; Operating Temperature: -55°C ~ 125°C; Ratings: -; Failure Rate: -; Mounting Type: Surface Mount, MLCC; Package / Case: 0603 (1608 Metric); Size / Dimension: 0.063" L x 0.032" W (1.60mm x 0.80mm); Height - Seated (Max): -; Thickness (Max): 0.034" (0.87mm); Lead Spacing: -; Lead Style: -; ComponentLink1URL: http://www.kemet.com/docfinder?Partnumber=C0603C103J5JAC7867; ComponentLink1Description: http://www.kemet.com/docfinder?Partnumber=C0603C103J5JAC7867; Tolerance: ±5%
R3 R10-R13 R15 R16 = RES 1K OHM 5% 1/10W 0603: 1k Ohm ±5% 0.1W, 1/10W Chip Resistor 0603 (1608 Metric); Manufacturer: Yageo; Manufacturer Part Number: RC0603JR-071KL; Temperature Coefficient: ±100ppm/°C; Supplier 1: Digi-Key; Supplier Part Number 1: 311-1.0KGRCT-ND; RoHS: RoHS Compliant; Category: Resistors; Stock 1: 4415240; Pricing 1: 1=0.15, 10=0.017, 100=0.0071, 1000=0.0032, 2500=0.00278 (CAD); Packaging: Cut Tape (CT); Part Status: Active; Resistance (Ohms): 1k; Tolerance: ±5%; Power (Watts): 0.1W, 1/10W; Composition: Thick Film; Features: Moisture Resistant; Operating Temperature: -55°C ~ 155°C; Package / Case: 0603 (1608 Metric); Supplier Device Package: 0603; Size / Dimension: 0.063" L x 0.031" W (1.60mm x 0.80mm); Height - Seated (Max): 0.022" (0.55mm); Failure Rate: -; ComponentLink1URL: http://www.yageo.com/documents/recent/PYu-RC_Group_51_RoHS_L_7.pdf; ComponentLink1Description: http://www.yageo.com/documents/recent/PYu-RC_Group_51_RoHS_L_7.pdf
R4-R9 R14 = RES 10K OHM 1% 1/10W 0603: as R1 on sheet Center Console - Connectors; Supplier 1: Digi-Key; Supplier Part Number 1: 311-10.0KHRCT-ND; Packaging: Cut Tape (CT); Part Status: Active; Composition: Thick Film; Operating Temperature: -55°C ~ 155°C; Package / Case: 0603 (1608 Metric); Supplier Device Package: 0603; Size / Dimension: 0.063" L x 0.031" W (1.60mm x 0.80mm); Height - Seated (Max): 0.022" (0.55mm); Failure Rate: -; ComponentLink1URL: http://www.yageo.com/documents/recent/PYu-RC_Group_51_RoHS_L_7.pdf; ComponentLink1Description: http://www.yageo.com/documents/recent/PYu-RC_Group_51_RoHS_L_7.pdf; Tolerance: ±1%
U2 = IC INVERTER SCHMITT 1CH SC70-5: Inverter IC 1 Channel Schmitt Trigger SC-70-5; Manufacturer: STMicroelectronics; Number of Inputs: 6; Propagation Delay: 21ns; Max Supply Voltage: 6V; Min Supply Voltage: 2V; Quiescent Current: 1uA; High Level Output Current: 5.2mA; Turn-On Delay Time: 25ns; Number of Bits: 1; RoHS: Yes; Mount: Surface Mount; Case/Package: TSSOP; Number of Pins: 14; Weight: 0.004949oz; Min Operating Temperature: -40°C; Max Operating Temperature: 125°C; Packaging: Tape and Reel; Package Quantity: 2500; Logic Function: Inverter; Number of Circuits: 6; Low Level Output Current: 5.2mA; Lead Free: Lead Free; Supplier 1: Digi-Key; Stock 1: 11031; Pricing 1: 1 = 0.36000, 10 = 0.29000, 100 = 0.19780, 500 = 0.14832, 1000 = 0.11124 (USD); Supplier Part Number 1: 296-47215-1-ND

## Sheet Center Console - LED Interface.SchDoc: Center Console - LED Interface
size B; Organization: Midnight Sun Solar Rayce Car Team; Address1: University of Waterloo; Address2: 200 University Ave W; Address3: Waterloo, ON, Canada; Address4: N2L 3E9; DocumentNumber: 3; SheetNumber: 3; SheetTotal: 4; Website: www.uwmidsun.com; ProjectName: ProjectName
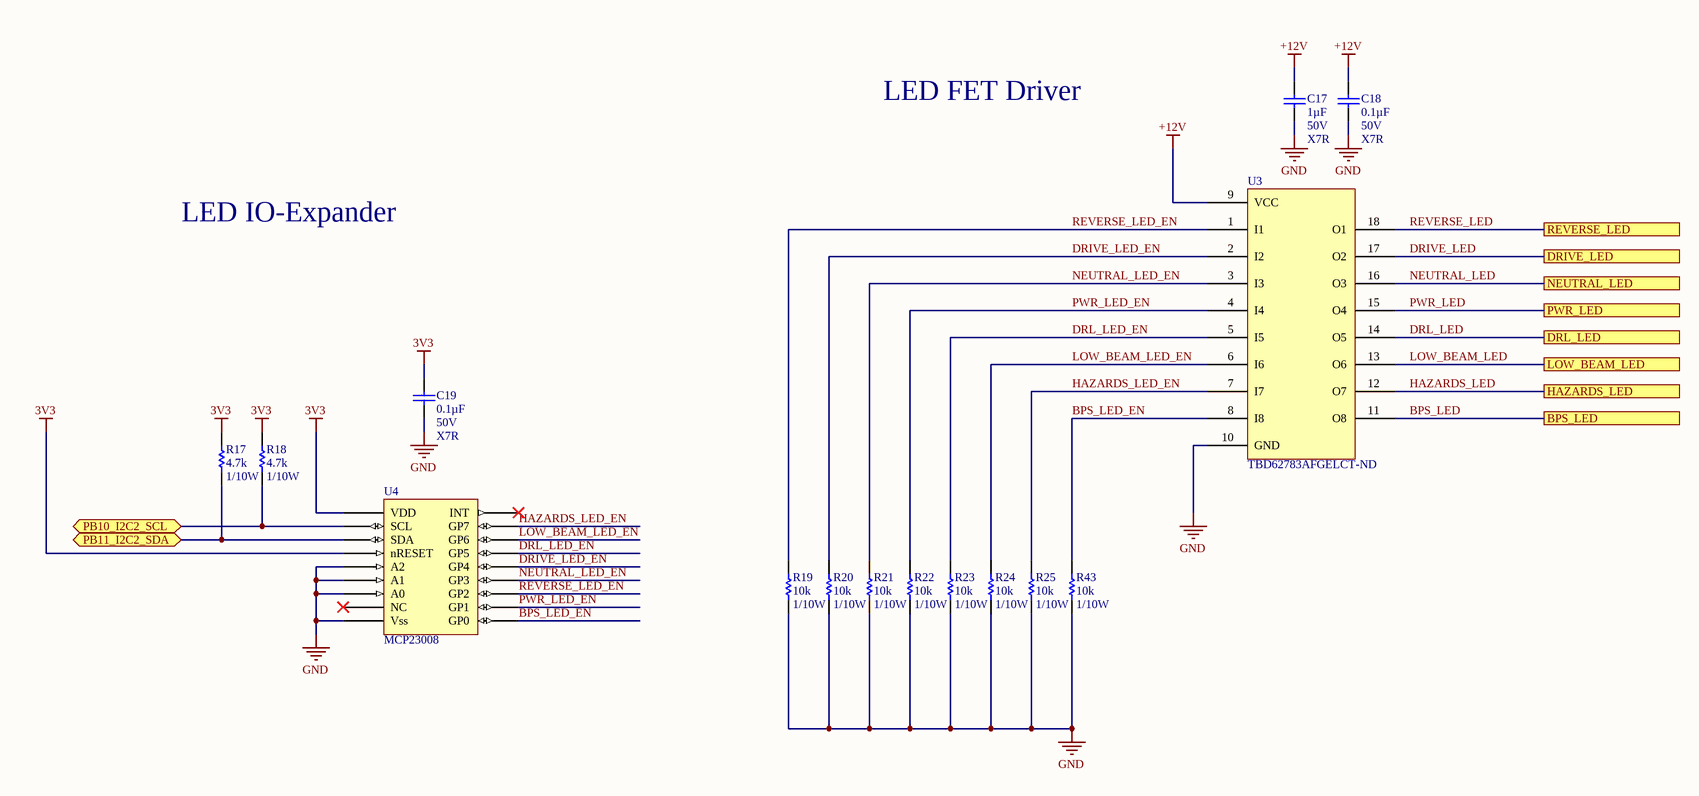
[diagram p2: Center Console - LED Interface.SchDoc]

### Parts
C17  Capacitance: 1µF  Voltage: 50V  Temperature Coefficient: X7R  [CAP, 0603]  (hidden comment: CAP CER 1UF 50V 10% X7R 0603)
C18  Capacitance: 0.1µF  Voltage: 50V  Temperature Coefficient: X7R  [CAP, 0603]  (hidden comment: CAP CER 0.1UF 50V 10% X7R 0603)
C19  Capacitance: 0.1µF  Voltage: 50V  Temperature Coefficient: X7R  [CAP, 0603]  (hidden comment: CAP CER 0.1UF 50V 10% X7R 0603)
R17  Resistance (Ohms): 4.7k  Power (Watts): 1/10W  [RES, 0603]  (hidden comment: RES 4.7K OHM 1% 1/10W 0603)
R18  Resistance (Ohms): 4.7k  Power (Watts): 1/10W  [RES, 0603]  (hidden comment: RES 4.7K OHM 1% 1/10W 0603)
R19  Resistance: 10k  Power: 1/10W  [RES, 0603]  (hidden comment: RES 10K OHM 1% 1/10W 0603)
R20  Resistance: 10k  Power: 1/10W  [RES, 0603]  (hidden comment: RES 10K OHM 1% 1/10W 0603)
R21  Resistance: 10k  Power: 1/10W  [RES, 0603]  (hidden comment: RES 10K OHM 1% 1/10W 0603)
R22  Resistance: 10k  Power: 1/10W  [RES, 0603]  (hidden comment: RES 10K OHM 1% 1/10W 0603)
R23  Resistance: 10k  Power: 1/10W  [RES, 0603]  (hidden comment: RES 10K OHM 1% 1/10W 0603)
R24  Resistance: 10k  Power: 1/10W  [RES, 0603]  (hidden comment: RES 10K OHM 1% 1/10W 0603)
R25  Resistance: 10k  Power: 1/10W  [RES, 0603]  (hidden comment: RES 10K OHM 1% 1/10W 0603)
R43  Resistance: 10k  Power: 1/10W  [RES, 0603]  (hidden comment: RES 10K OHM 1% 1/10W 0603)
U3  Supplier Part Number 1: TBD62783AFGELCT-ND  [IC LOAD SWITCH 8CH 0.5A 18-SSOP]  (hidden comment: IC LOAD SWITCH 8CH 0.5A 18SOP)
U4  MCP23008  [IC 18SOIC]

### Ports
BPS_LED, DRIVE_LED, DRL_LED, HAZARDS_LED, LOW_BEAM_LED, NEUTRAL_LED, PB10_I2C2_SCL (bidir), PB11_I2C2_SDA (bidir), PWR_LED, REVERSE_LED

### Nets
3V3: C19.1 R17.1 R18.1 U4.6(nRESET) U4.18(VDD)
+12V: C17.1 C18.1 U3.9(VCC)
GND: C17.2 C18.2 C19.2 R19.2 R20.2 R21.2 R22.2 R23.2 R24.2 R25.2 R43.2 U3.10(GND) U4.3(A2) U4.4(A1) U4.5(A0) U4.9(Vss)
BPS_LED: U3.11(O8) ; port BPS_LED
BPS_LED_EN: R43.1 U3.8(I8) U4.10(GP0)  [project net BPS_LED_EN_3]
DRIVE_LED: U3.17(O2) ; port DRIVE_LED
DRIVE_LED_EN: R20.1 U3.2(I2) U4.14(GP4)  [project net DRIVE_LED_EN_3]
DRL_LED: U3.14(O5) ; port DRL_LED
DRL_LED_EN: R23.1 U3.5(I5) U4.15(GP5)  [project net DRL_LED_EN_3]
HAZARDS_LED: U3.12(O7) ; port HAZARDS_LED
HAZARDS_LED_EN: R25.1 U3.7(I7) U4.17(GP7)  [project net HAZARDS_LED_EN_3]
LOW_BEAM_LED: U3.13(O6) ; port LOW_BEAM_LED
LOW_BEAM_LED_EN: R24.1 U3.6(I6) U4.16(GP6)  [project net LOW_BEAM_LED_EN_3]
NEUTRAL_LED: U3.16(O3) ; port NEUTRAL_LED
NEUTRAL_LED_EN: R21.1 U3.3(I3) U4.13(GP3)  [project net NEUTRAL_LED_EN_3]
PB10_I2C2_SCL: R18.2 U4.1(SCL) ; port PB10_I2C2_SCL
PB11_I2C2_SDA: R17.2 U4.2(SDA) ; port PB11_I2C2_SDA
PWR_LED: U3.15(O4) ; port PWR_LED
PWR_LED_EN: R22.1 U3.4(I4) U4.11(GP1)  [project net PWR_LED_EN_3]
REVERSE_LED: U3.18(O1) ; port REVERSE_LED
REVERSE_LED_EN: R19.1 U3.1(I1) U4.12(GP2)  [project net REVERSE_LED_EN_3]

Not connected (* = marked no-connect by the designer): U4 7(NC)* 8(INT)*

### Notes on the sheet
- LED FET Driver
- LED IO-Expander
- PROJECT
- DOCUMENT
- DRAWN BY
- LAST MODIFIED
- PART NUMBER
- REVISION
- SHEET
- VARIANT
- OF
- Engineering 5 - 1002
  University of Waterloo
  (519) 888-4567 x32978
  hardware@uwmidsun.com

### Library data of the parts
C17 = CAP CER 1UF 50V 10% X7R 0603: 1µF ±10% 50V Ceramic Capacitor X7R 0603 (1608 Metric); Manufacturer 1: Taiyo Yuden; Manufacturer Part Number 1: UMK107AB7105KA-T; Supplier 1: Digi-Key; Supplier Part Number 1: 587-3247-1-ND; Packaging: Cut Tape (CT); Part Status: Active; Operating Temperature: -55°C ~ 125°C; Ratings: -; Mounting Type: Surface Mount, MLCC; Package / Case: 0603 (1608 Metric); Size / Dimension: 0.063" L x 0.031" W (1.60mm x 0.80mm); Height - Seated (Max): -; Thickness (Max): 0.037" (0.95mm); Lead Spacing: -; Lead Style: -; ComponentLink1URL: http://www.yuden.co.jp/productdata/catalog/en/mlcc_all_e.pdf; ComponentLink1Description: http://www.yuden.co.jp/productdata/catalog/en/mlcc_all_e.pdf; Tolerance: ±10%
C18 C19 = CAP CER 0.1UF 50V 10% X7R 0603: as C1 on sheet Center Console - Buttons Interface; Supplier 1: Digi-Key; Supplier Part Number 1: 478-5052-1-ND; Packaging: Cut Tape (CT); Part Status: Active; Operating Temperature: -55°C ~ 125°C; Ratings: -; Mounting Type: Surface Mount, MLCC; Package / Case: 0603 (1608 Metric); Size / Dimension: 0.063" L x 0.032" W (1.60mm x 0.81mm); Height - Seated (Max): -; Thickness (Max): 0.035" (0.90mm); Lead Spacing: -; Lead Style: -; ComponentLink1URL: http://datasheets.avx.com/X7RDielectric.pdf; ComponentLink1Description: http://datasheets.avx.com/X7RDielectric.pdf; Tolerance: ±10%
R17 R18 = RES 4.7K OHM 1% 1/10W 0603: 4.7k Ohm ±1% 0.1W, 1/10W Chip Resistor 0603 (1608 Metric) Moisture Resistant Thick Film; Manufacturer 1: Yageo; Manufacturer Part Number 1: RC0603FR-074K7L; Description 1: RES SMD 4.7K OHM 1% 1/10W 0603; Temperature Coefficient: ±100ppm/°C; Supplier 1: Digi-Key; Supplier Part Number 1: 311-4.70KHRCT-ND; RoHS: RoHS Compliant; Category: Resistors; Stock 1: 3487566; Pricing 1: 1=0.16, 10=0.022, 100=0.0089, 1000=0.00402, 2500=0.00349 (CAD); Packaging: Cut Tape (CT); Part Status: Active; Composition: Thick Film; Features: Moisture Resistant; Operating Temperature: -55°C ~ 155°C; Package / Case: 0603 (1608 Metric); Supplier Device Package: 0603; Size / Dimension: 0.063" L x 0.031" W (1.60mm x 0.80mm); Height - Seated (Max): 0.022" (0.55mm); Failure Rate: -; ComponentLink1URL: http://www.yageo.com/documents/recent/PYu-RC_Group_51_RoHS_L_7.pdf; ComponentLink1Description: http://www.yageo.com/documents/recent/PYu-RC_Group_51_RoHS_L_7.pdf; Tolerance: ±1%
R19-R25 R43 = RES 10K OHM 1% 1/10W 0603: as R1 on sheet Center Console - Connectors; Supplier 1: Digi-Key; Supplier Part Number 1: 311-10.0KHRCT-ND; Packaging: Cut Tape (CT); Part Status: Active; Composition: Thick Film; Operating Temperature: -55°C ~ 155°C; Package / Case: 0603 (1608 Metric); Supplier Device Package: 0603; Size / Dimension: 0.063" L x 0.031" W (1.60mm x 0.80mm); Height - Seated (Max): 0.022" (0.55mm); Failure Rate: -; ComponentLink1URL: http://www.yageo.com/documents/recent/PYu-RC_Group_51_RoHS_L_7.pdf; ComponentLink1Description: http://www.yageo.com/documents/recent/PYu-RC_Group_51_RoHS_L_7.pdf; Tolerance: ±1%
U3 = IC LOAD SWITCH 8CH 0.5A 18SOP: IC LOAD SWITCH 8CHANNEL 0.5A 18SOP; Manufacturer: Toshiba; Manufacturer Part Number: TBD62783AFG,EL; Number of Outputs: 8; Interface: On/Off; Max Output Current: 500mA; Output Configuration: High Side; Supplier 1: Digi-Key; RoHS: Yes; Stock 1: 8776; Pricing 1: 1 = 1.15000, 10 = 1.02200, 25 = 0.92280, 100 = 0.80750, 250 = 0.70864, 500 = 0.62624 (USD); Case/Package: SOIC; Number of Pins: 18; Min Operating Temperature: -40°C; Max Operating Temperature: 85°C; Packaging: Cut Tape
U4 = IC I/O EXPANDER I2C 8B 18SOIC: MCP23008 I/O Expander 8B+1Int 18P SOIC; Manufacturer: Microchip Technology; Manufacturer Part Number: MCP23008T-E/SO; Number of I/O: 8; Interface: I²C; Interrupt Output: Yes; Output Type: Push-Pull; Current - Output Source/Sink: 25mA; Voltage - Supply: 1.8 V ~ 5.5 V; Supplier 1: Digi-Key; Supplier Part Number 1: MCP23008T-E/SOCT-ND; RoHS: RoHS Compliant; Category: Integrated Circuits (ICs); Stock 1: 5607; Pricing 1: 1=1.62, 25=1.3548, 100=1.2431 (CAD); Packaging: Cut Tape (CT); Part Status: Active; Features: POR; Operating Temperature: -40°C ~ 125°C; Mounting Type: Surface Mount; Package / Case: 18-SOIC (0.295", 7.50mm Width); Supplier Device Package: 18-SOIC; ComponentLink1URL: http://www.microchip.com/mymicrochip/filehandler.aspx?ddocname=en021920; ComponentLink1Description: http://www.microchip.com/mymicrochip/filehandler.aspx?ddocname=en021920